# EAGLE design watchdog (EAGLE 7.0.0)
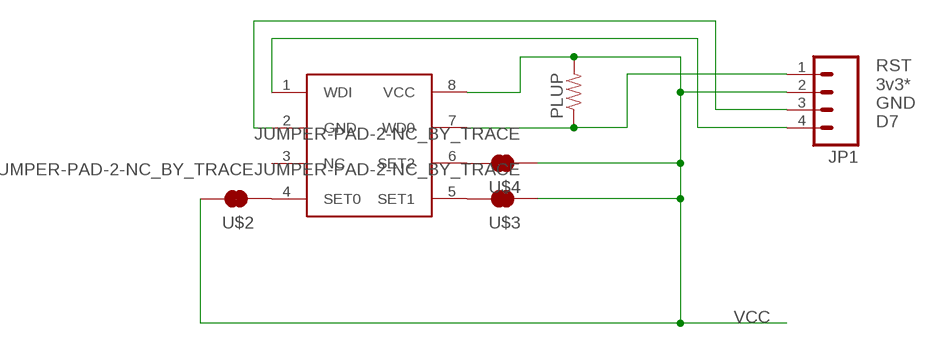
[diagram p0: schematic, sheet 1]

## Parts
JP1  M04LOCK  [1X04_LOCK]
PLUP  RESISTOR0603-RES  [0603-RES]
U$1  MAX6374KA  [SOT23-8L]
U$2  JUMPER-PAD-2-NC_BY_TRACE  [PAD-JUMPER-2-NC_BY_TRACE_YES_SILK]
U$3  JUMPER-PAD-2-NC_BY_TRACE  [PAD-JUMPER-2-NC_BY_TRACE_YES_SILK]
U$4  JUMPER-PAD-2-NC_BY_TRACE  [PAD-JUMPER-2-NC_BY_TRACE_YES_SILK]

## Nets
GND: JP1.3 U$1.2(GND)
N$1: U$1.4(SET0) U$2.1
N$2: U$1.5(SET1) U$3.2
N$3: U$1.6(SET2) U$4.2
N$4: JP1.1 PLUP.1 U$1.7(WD0)
N$6: JP1.4 U$1.1(WDI)
VCC: JP1.2 PLUP.2 U$1.8(VCC) U$2.2 U$3.1 U$4.1
Unconnected: U$1.3(NC)

## Notes on the sheet
- RST
  3v3*
  GND
  D7

## Library data of the parts
JP1 = SparkFun-Connectors:M04: Header 4 Standard 4-pin 0.1" header. Use with straight break away headers (SKU : PRT-00116), right angle break away headers (PRT-00553), swiss pins (PRT-00743), machine pins (PRT-00117), and female headers (PRT-00115). Molex polarized connector foot print use with SKU : PRT-08231 with associated crimp pins and housings. 1MM SMD Version SKU: PRT-10208
PLUP = SparkFun-Passives:RESISTOR: Resistor Basic schematic elements and footprints for 0603, 1206, and PTH resistors.
U$1 = mylibrary:MAX6374KA
U$2-U$4 = SparkFun-Passives:JUMPER-PAD-2-NC_BY_TRACE

## Board
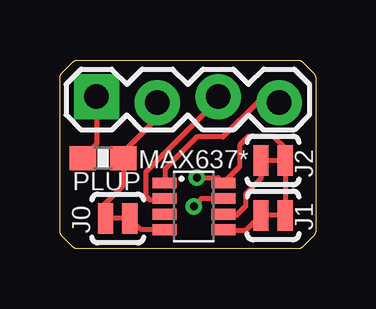
[diagram p1: board, top side]
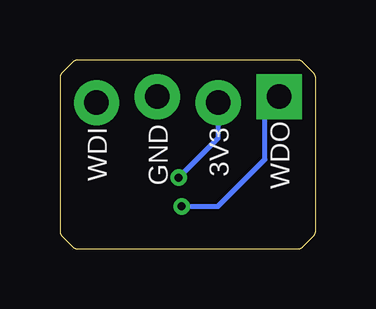
[diagram p2: board, bottom side, seen from below]

Size 10.67 x 7.87 mm. Coordinates in mm from the lower left corner, seen from the top.
Outline: 0,0.74 0,7.13 arc-45 0.07,7.31 0.56,7.8 arc-45 0.74,7.87 9.93,7.87 arc-45 10.11,7.8 10.59,7.31 arc-45 10.67,7.13 10.67,0.74 arc-45 10.59,0.56 10.11,0.07 arc-45 9.93,0 0.74,0 arc-45 0.56,0.07 0.07,0.56 arc-45 0,0.74
Copper layers (1*16): Top 0.0356mm / dielectric 1.5011mm / Bottom 0.0356mm
Design rules "LaenPCBOrder *": minimum track width 6mil, minimum drill 13mil, track to track 6mil, track to pad 6mil, pad to pad 6mil, via to via 6mil, smd to smd 6mil, copper to edge 15mil, drill to drill 6mil, minimum pad ring 7mil, minimum via ring 7mil, stop-mask expansion 3mil, vias tented up to drill 15mil, thermal gap 10mil

### Footprints (pad centres in the part's own frame; a part is rotated, then mirrored left to right if it is on the bottom)
1X04_LOCK = drill 1.016 pad 1.88 square: 1 0,0.127 | drill 1.016 pad 1.88: 2 2.54,-0.127; 3 5.08,0.127; 4 7.62,-0.127
0603-RES = smd 1.1 x 1: 1 -0.85,0; 2 0.85,0
SOT23-8L = smd 0.45 x 1: 1 -0.975,-1.225; 2 -0.325,-1.225; 3 0.325,-1.225; 4 0.975,-1.225; 5 0.975,1.225; 6 0.325,1.225; 7 -0.325,1.225; 8 -0.975,1.225
PAD-JUMPER-2-NC_BY_TRACE_YES_SILK = smd 0.635 x 1.27: 1 -0.508,0; 2 0.508,0

### Placement (x,y rotation side)
JP1  1.52,6.22 0 top
PLUP  1.8,3.78 0 top
U$1  5.59,1.78 270 top
U$2  2.41,1.27 180 top
U$3  8.89,1.4 180 top
U$4  8.89,3.68 180 top

### Tracks (layer width: path | path; a pad name or v marks a point on that pad's centre or on a via)
GND
  Top 0.203: JP1.3 6.6,6.22 3.58,3.2 3.58,2.21 3.73,2.06 4.32,2.06 U$1.2
N$1
  Top 0.203: U$1.4 3.39,0.8 U$2.1
N$2
  Top 0.203: U$3.2 7.75,0.76 6.85,0.76 U$1.5
N$3
  Top 0.203: U$4.2 8.38,2.92 7.75,2.29 7.75,1.78 7.37,1.4 6.87,1.4 U$1.6
N$4  (via drill 0.33)
  Top 0.203: JP1.1 1.52,4.36 PLUP.1 | U$1.7 5.91,2.1 v5.59,1.78
  Bottom 0.203: v5.59,1.78 4.06,1.78 2.11,3.73 2.11,5.77 JP1.1
N$6
  Top 0.203: JP1.4 8.23,6.1 6.81,4.67 5.72,4.67 4.39,3.35 4.39,2.78 U$1.1
VCC  (via drill 0.33)
  Top 0.203: U$3.1 U$4.1 9.4,4.19 8.89,4.7 7.87,4.7 7.49,4.32 7.49,3.43 U$1.8 6.59,2.97 v5.72,2.97 | U$2.2 1.78,1.4 1.78,1.78 2.65,2.65 PLUP.2 2.65,4.05 4.06,5.46 JP1.2
  Bottom 0.203: JP1.2 4.06,4.62 v5.72,2.97

### Text on the board
tNames: MAX637* | J2 | J0 | J1
bNames: WDO | 3V3 | GND | WDI